# Altium schematic sheet power supply.SchDoc
size A4; SheetNumber: 2; SheetTotal: 5
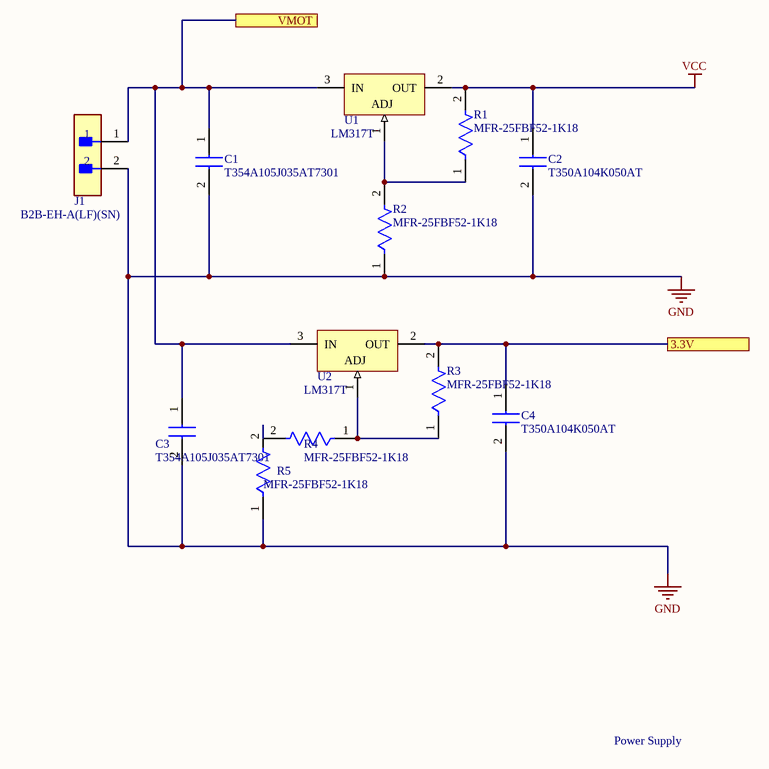
[diagram p0: power supply.SchDoc]

## Parts
C1  T354A105J035AT7301  [T354A105J035AT7301]
C2  T350A104K050AT  [T350A104K050AT]
C3  T354A105J035AT7301  [T354A105J035AT7301]
C4  T350A104K050AT  [T350A104K050AT]
J1  B2B-EH-A(LF)(SN)  [FP-B2B-EH-A_LF_SN-MFG]
R1  MFR-25FBF52-1K18  [FP-MFR-25-MFG]
R2  MFR-25FBF52-1K18  [FP-MFR-25-MFG]
R3  MFR-25FBF52-1K18  [FP-MFR-25-MFG]
R4  MFR-25FBF52-1K18  [FP-MFR-25-MFG]
R5  MFR-25FBF52-1K18  [FP-MFR-25-MFG]
U1  LM317T  [NDE0003A]
U2  LM317T  [NDE0003A]

## Ports
3.3V, VMOT

## Nets
GND: C1.2(-) C2.2 C3.2(-) C4.2 J1.2 R2.1 R5.1
VCC: C2.1 R1.2 U1.2(OUT)
3.3V: C4.1 R3.2 U2.2(OUT) ; port 3.3V
VMOT: C1.1(+) C3.1(+) J1.1 U1.3(IN) U2.3(IN) ; port VMOT
NetR1_1: R1.1 R2.2 U1.1(ADJ)
NetR3_1: R3.1 R4.1 U2.1(ADJ)
NetR4_2: R4.2 R5.2

## Notes on the sheet
- Power Supply

## Library data of the parts
C1 C3 = T354A105J035AT7301: Capacitor; Manufacturer_Name: KEMET; Datasheet Link: https://content.kemet.com/datasheets/KEM_T2043_T35X.pdf; Height: 8.6mm; Manufacturer_Part_Number: T354A105J035AT7301; Mouser Part Number: 80-T354A105J35AT-TR; Mouser Price/Stock: https://www.mouser.co.uk/ProductDetail/KEMET/T354A105J035AT7301?qs=eaG68hM7nzPCdlzS1u%252BjMg%3D%3D
C2 C4 = T350A104K050AT: Capacitor; Manufacturer_Name: KEMET; Datasheet Link: https://content.kemet.com/datasheets/KEM_T2043_T35X.pdf; Height: 7.1mm; Manufacturer_Part_Number: T350A104K050AT; Mouser Part Number: 80-T350A104K50AT; Mouser Price/Stock: https://www.mouser.co.uk/ProductDetail/KEMET/T350A104K050AT?qs=O4djsYW3Gvb%252Bsic1QYKKdw%3D%3D; Arrow Part Number: T350A104K050AT; Arrow Price/Stock: https://www.arrow.com/en/products/t350a104k050at/kemet-corporation?region=nac
J1 = CMP-17439-000026-1: CONN HEADER VERT 2POS 2.5MM; Number of Contacts: 2; Current Rating: 3A; Connector Type: Plug; Contact Resistance: 20mR; Gender: Male; Voltage Rating: 250V; Fastening Type: Detent; Depth: 3.8mm; Max Operating Temperature: 85°C; Orientation: Straight; Series: EH; Contact Plating: Tin; Min Operating Temperature: -25°C; Contact Type: Male Pin; Housing Color: White; Termination: Press-Fit; Housing Material: Nylon; Pitch: 2.5mm; Number of Positions: 2; Max Current Rating: 3A; Packaging: Bulk; Lead Free: Lead Free; Number of Rows: 1; Length: 7.5mm; Contact Mating Length: 0.13inch; Color: Natural; Max Voltage Rating (AC): 250V; Contact Material: Copper Alloy; Mount: Through Hole
R1-R5 = CMP-03413-000001-1: RES 1.18K OHM 1/4W 1% AXIAL; Manufacturer: Yageo; Value: 1.18kΩ; Temperature Coefficient: 100ppm/°C; Power Rating: 0.25W; Voltage Rating: 250V; Temperature: -55°C to +155°C; Automotive: No; Temperature Range High: +155°C; Mouser Description: Metal Film Resistors 1.18K OHM 1/4W 1%; Digikey Description: RES 1.18K OHM 1/4W 1% AXIAL; Lead Free: Yes; Tolerance: 1%; ComponentLink2Description: Datasheet; ComponentLink2URL: https://www.yageo.com/upload/media/product/products/datasheet/lr/Yageo_LR_MFR_1.pdf; Temperature Range Low: -55°C; Package: MFR-25; Ipc Land Pattern Name: RESAD1000W75L680D260; Composition: Metal Film; Category: Res; Octopart: https://octopart.com/mfr-25fbf52-1k18-yageo-56251681; Series: MFR; Device Class L2: Resistors; Height: 2.6mm; Resistance: 1.18kΩ; Device Class L3: Through-Hole Resistors; Manufacturer Part Number: MFR-25FBF52-1K18; RoHS: TRUE; Device Class L1: Passive Components
U1 U2 = CMP-0062-02456-3: 3-Terminal Adjustable Regulator, 3-pin TO-220; Manufacturer: Texas Instruments; CompType: LDO IC; PowerWise: N; PackageTopMarking: NSUZXYTTE#*LM317T P+; ComponentLink1Description: Datasheet URL; PackageReference: NDE0003A; PinCount: 3; ComponentLink1URL: http://www.ti.com/general/docs/lit/getliterature.tsp?genericPartNumber=LM317-N&fileType=pdf; RoHS: N; PackageDescription: TO-220, Molded, 3 Lead, Straight